# EAGLE design Arduino-CMRI_SMD_v7_Nano (EAGLE 7.6.0)
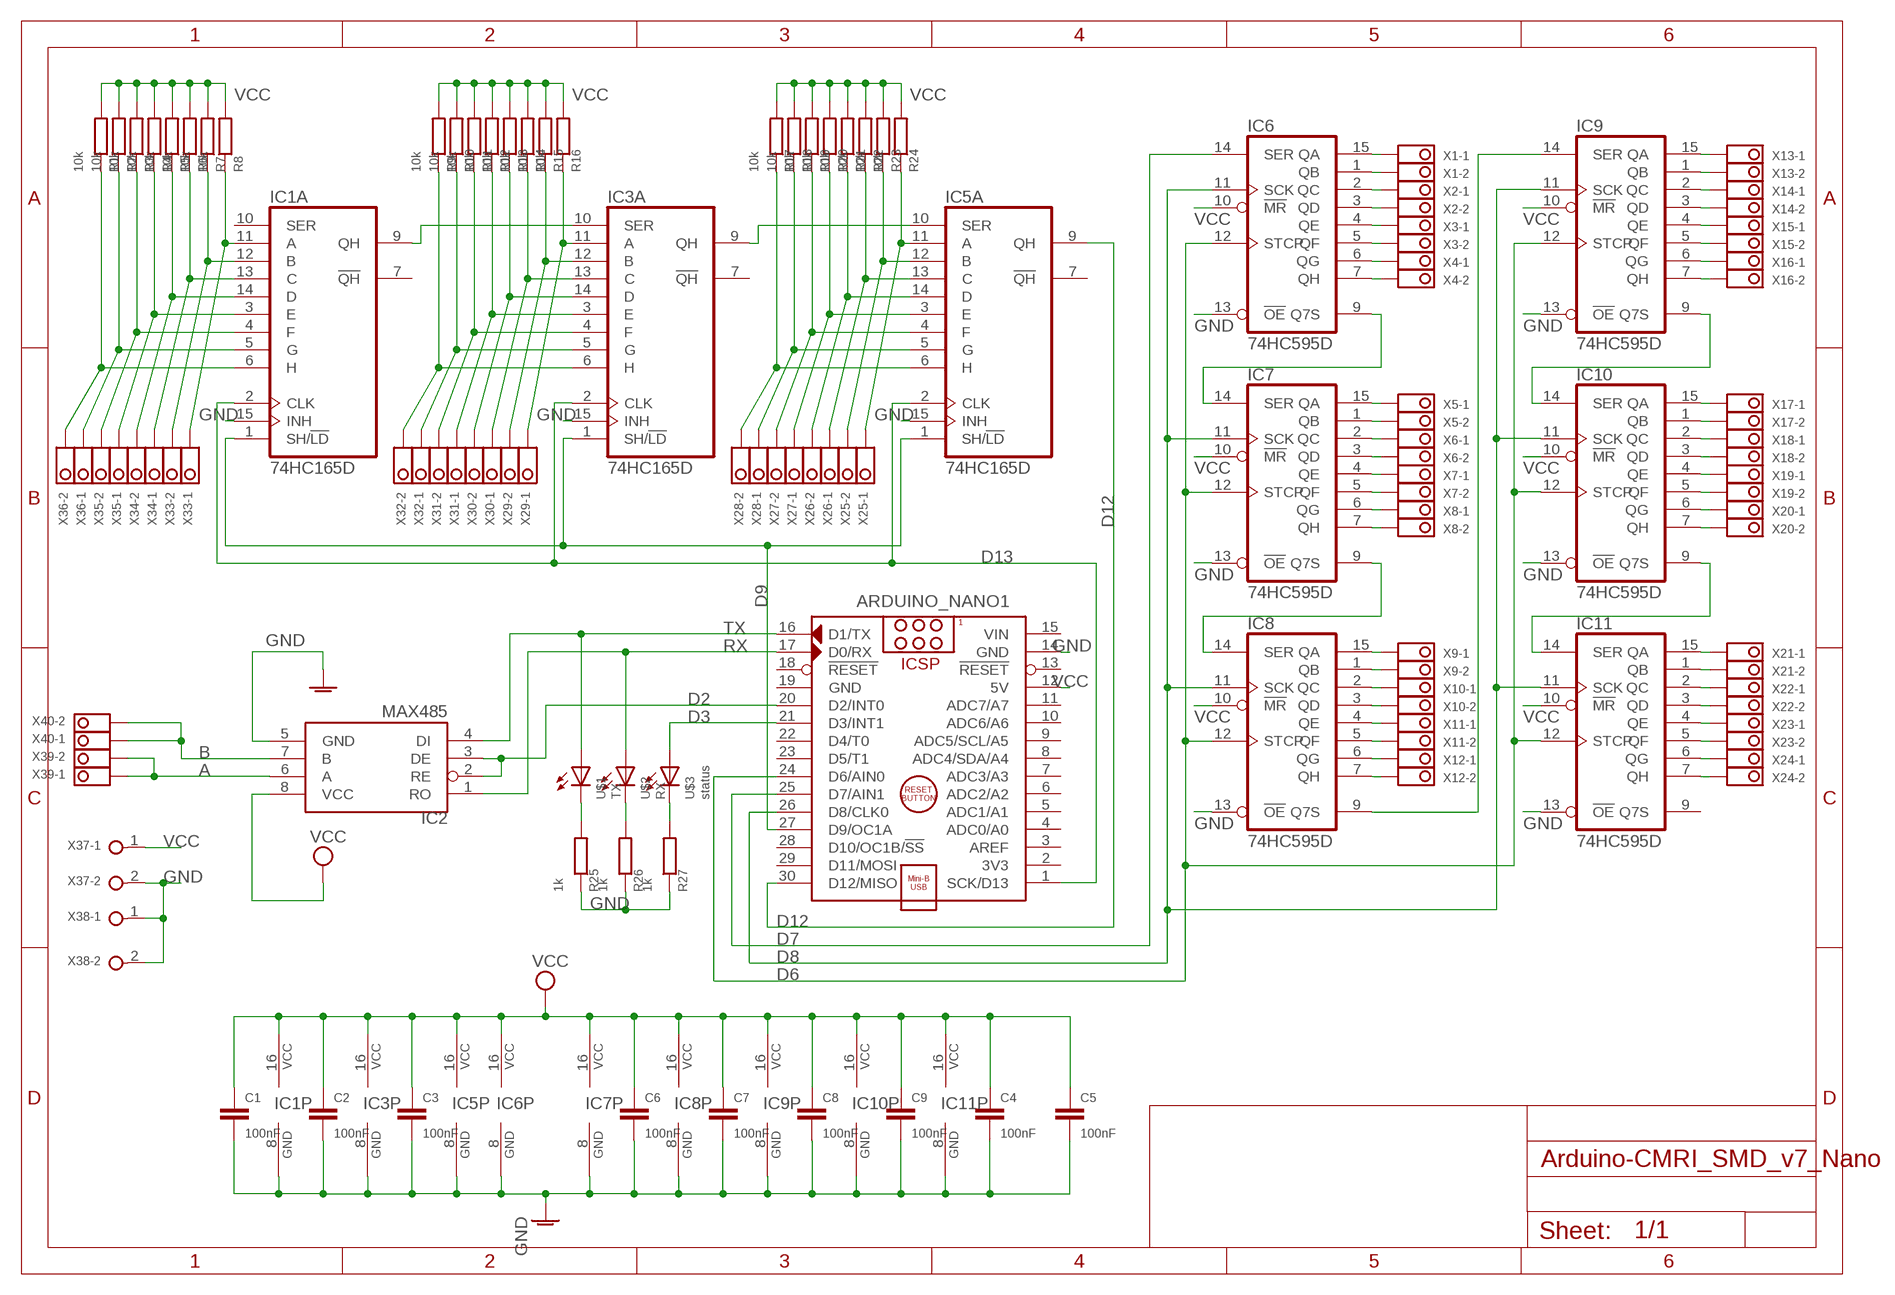
[diagram p0: schematic, sheet 1]

## Parts
ARDUINO_NANO1  ARDUINO_NANO  [ARDUINO_NANO]
C1  100nF  CERAMIC-CAP  [1206]
C2  100nF  CERAMIC-CAP  [1206]
C3  100nF  CERAMIC-CAP  [1206]
C4  100nF  CERAMIC-CAP  [1206]
C5  100nF  CERAMIC-CAP  [1206]
C6  100nF  CERAMIC-CAP  [1206]
C7  100nF  CERAMIC-CAP  [1206]
C8  100nF  CERAMIC-CAP  [1206]
C9  100nF  CERAMIC-CAP  [1206]
IC1  74HC165D  [SO16]
IC2  MAX485  [SO08]
IC3  74HC165D  [SO16]
IC5  74HC165D  [SO16]
IC6  74HC595D  [SO16]
IC7  74HC595D  [SO16]
IC8  74HC595D  [SO16]
IC9  74HC595D  [SO16]
IC10  74HC595D  [SO16]
IC11  74HC595D  [SO16]
R1  10k  RESISTOR-SMD-1206  [R1206W]
R2  10k  RESISTOR-SMD-1206  [R1206W]
R3  10k  RESISTOR-SMD-1206  [R1206W]
R4  10k  RESISTOR-SMD-1206  [R1206W]
R5  10k  RESISTOR-SMD-1206  [R1206W]
R6  10k  RESISTOR-SMD-1206  [R1206W]
R7  10k  RESISTOR-SMD-1206  [R1206W]
R8  10k  RESISTOR-SMD-1206  [R1206W]
R9  10k  RESISTOR-SMD-1206  [R1206W]
R10  10k  RESISTOR-SMD-1206  [R1206W]
R11  10k  RESISTOR-SMD-1206  [R1206W]
R12  10k  RESISTOR-SMD-1206  [R1206W]
R13  10k  RESISTOR-SMD-1206  [R1206W]
R14  10k  RESISTOR-SMD-1206  [R1206W]
R15  10k  RESISTOR-SMD-1206  [R1206W]
R16  10k  RESISTOR-SMD-1206  [R1206W]
R17  10k  RESISTOR-SMD-1206  [R1206W]
R18  10k  RESISTOR-SMD-1206  [R1206W]
R19  10k  RESISTOR-SMD-1206  [R1206W]
R20  10k  RESISTOR-SMD-1206  [R1206W]
R21  10k  RESISTOR-SMD-1206  [R1206W]
R22  10k  RESISTOR-SMD-1206  [R1206W]
R23  10k  RESISTOR-SMD-1206  [R1206W]
R24  10k  RESISTOR-SMD-1206  [R1206W]
R25  1k  RESISTOR-SMD-1206  [R1206W]
R26  1k  RESISTOR-SMD-1206  [R1206W]
R27  1k  RESISTOR-SMD-1206  [R1206W]
U$1  TX  LED-0603CHIPLED_0603_V1  [CHIPLED_0603]
U$2  RX  LED-0603CHIPLED_0603_V1  [CHIPLED_0603]
U$3  status  LED-0603CHIPLED_0603_V1  [CHIPLED_0603]
X1  TERMINAL_2P_3,5MM_V2  [TERMINAL_2P_3,5MM]
X2  TERMINAL_2P_3,5MM_V2  [TERMINAL_2P_3,5MM]
X3  TERMINAL_2P_3,5MM_V2  [TERMINAL_2P_3,5MM]
X4  TERMINAL_2P_3,5MM_V2  [TERMINAL_2P_3,5MM]
X5  TERMINAL_2P_3,5MM_V2  [TERMINAL_2P_3,5MM]
X6  TERMINAL_2P_3,5MM_V2  [TERMINAL_2P_3,5MM]
X7  TERMINAL_2P_3,5MM_V2  [TERMINAL_2P_3,5MM]
X8  TERMINAL_2P_3,5MM_V2  [TERMINAL_2P_3,5MM]
X9  TERMINAL_2P_3,5MM_V2  [TERMINAL_2P_3,5MM]
X10  TERMINAL_2P_3,5MM_V2  [TERMINAL_2P_3,5MM]
X11  TERMINAL_2P_3,5MM_V2  [TERMINAL_2P_3,5MM]
X12  TERMINAL_2P_3,5MM_V2  [TERMINAL_2P_3,5MM]
X13  TERMINAL_2P_3,5MM_V2  [TERMINAL_2P_3,5MM]
X14  TERMINAL_2P_3,5MM_V2  [TERMINAL_2P_3,5MM]
X15  TERMINAL_2P_3,5MM_V2  [TERMINAL_2P_3,5MM]
X16  TERMINAL_2P_3,5MM_V2  [TERMINAL_2P_3,5MM]
X17  TERMINAL_2P_3,5MM_V2  [TERMINAL_2P_3,5MM]
X18  TERMINAL_2P_3,5MM_V2  [TERMINAL_2P_3,5MM]
X19  TERMINAL_2P_3,5MM_V2  [TERMINAL_2P_3,5MM]
X20  TERMINAL_2P_3,5MM_V2  [TERMINAL_2P_3,5MM]
X21  TERMINAL_2P_3,5MM_V2  [TERMINAL_2P_3,5MM]
X22  TERMINAL_2P_3,5MM_V2  [TERMINAL_2P_3,5MM]
X23  TERMINAL_2P_3,5MM_V2  [TERMINAL_2P_3,5MM]
X24  TERMINAL_2P_3,5MM_V2  [TERMINAL_2P_3,5MM]
X25  TERMINAL_2P_3,5MM_V2  [TERMINAL_2P_3,5MM]
X26  TERMINAL_2P_3,5MM_V2  [TERMINAL_2P_3,5MM]
X27  TERMINAL_2P_3,5MM_V2  [TERMINAL_2P_3,5MM]
X28  TERMINAL_2P_3,5MM_V2  [TERMINAL_2P_3,5MM]
X29  TERMINAL_2P_3,5MM_V2  [TERMINAL_2P_3,5MM]
X30  TERMINAL_2P_3,5MM_V2  [TERMINAL_2P_3,5MM]
X31  TERMINAL_2P_3,5MM_V2  [TERMINAL_2P_3,5MM]
X32  TERMINAL_2P_3,5MM_V2  [TERMINAL_2P_3,5MM]
X33  TERMINAL_2P_3,5MM_V2  [TERMINAL_2P_3,5MM]
X34  TERMINAL_2P_3,5MM_V2  [TERMINAL_2P_3,5MM]
X35  TERMINAL_2P_3,5MM_V2  [TERMINAL_2P_3,5MM]
X36  TERMINAL_2P_3,5MM_V2  [TERMINAL_2P_3,5MM]
X37  TERMINAL-5MM-2POLE  [W237-132]
X38  TERMINAL-5MM-2POLE  [W237-132]
X39  TERMINAL_2P_3,5MM_V2  [TERMINAL_2P_3,5MM]
X40  TERMINAL_2P_3,5MM_V2  [TERMINAL_2P_3,5MM]

## Nets
A [Vcc]: IC2.6(A) X39.P$1 X39.P$2
B [Vcc]: IC2.7(B) X40.P$1 X40.P$2
D2: ARDUINO_NANO1.20(D2/INT0) IC2.2(RE) IC2.3(DE)
D3: ARDUINO_NANO1.21(D3/INT1) U$3.A
D6: ARDUINO_NANO1.24(D6/AIN0) IC6.12(STCP) IC7.12(STCP) IC8.12(STCP) IC9.12(STCP) IC10.12(STCP) IC11.12(STCP)
D7: ARDUINO_NANO1.25(D7/AIN1) IC6.14(SER)
D8: ARDUINO_NANO1.26(D8/CLK0) IC6.11(SCK) IC7.11(SCK) IC8.11(SCK) IC9.11(SCK) IC10.11(SCK) IC11.11(SCK)
D9: ARDUINO_NANO1.27(D9/OC1A) IC1.1(A:SH/!LD) IC3.1(A:SH/!LD) IC5.1(A:SH/!LD)
D12: ARDUINO_NANO1.30(D12/MISO) IC5.9(A:QH)
D13: ARDUINO_NANO1.1(SCK/D13) IC1.2(A:CLK) IC3.2(A:CLK) IC5.2(A:CLK)
GND [Vcc]: ARDUINO_NANO1.14(GND) C1.1 C2.1 C3.1 C4.1 C5.1 C6.1 C7.1 C8.1 C9.1 IC1.8(P:GND) IC1.15(A:INH) IC2.5(GND) IC3.8(P:GND) IC3.15(A:INH) IC5.8(P:GND) IC5.15(A:INH) IC6.8(GND) IC6.13(!OE) IC7.8(GND) IC7.13(!OE) IC8.8(GND) IC8.13(!OE) IC9.8(GND) IC9.13(!OE) IC10.8(GND) IC10.13(!OE) IC11.8(GND) IC11.13(!OE) R25.1 R26.1 R27.1 X37.2 X38.1 X38.2
N$1: IC5.11(A:A) R24.1 X25.P$1
N$2: IC1.9(A:QH) IC3.10(A:SER)
N$3: IC5.12(A:B) R23.1 X25.P$2
N$4: IC3.9(A:QH) IC5.10(A:SER)
N$5: IC5.13(A:C) R22.1 X26.P$1
N$6: IC6.9(Q7S) IC7.14(SER)
N$7: IC5.14(A:D) R21.1 X26.P$2
N$8: IC9.9(Q7S) IC10.14(SER)
N$9: IC5.3(A:E) R20.1 X27.P$1
N$10: IC7.9(Q7S) IC8.14(SER)
N$11: IC5.4(A:F) R19.1 X27.P$2
N$12: IC10.9(Q7S) IC11.14(SER)
N$13: IC5.5(A:G) R18.1 X28.P$1
N$14: IC6.15(QA) X1.P$1
N$15: IC5.6(A:H) R17.1 X28.P$2
N$16: IC6.1(QB) X1.P$2
N$17: R25.2 U$1.C
N$18: IC6.2(QC) X2.P$1
N$19: IC3.11(A:A) R16.1 X29.P$1
N$20: IC6.3(QD) X2.P$2
N$21: IC3.12(A:B) R15.1 X29.P$2
N$22: IC6.4(QE) X3.P$1
N$23: IC3.13(A:C) R14.1 X30.P$1
N$24: IC6.5(QF) X3.P$2
N$25: IC3.14(A:D) R13.1 X30.P$2
N$26: IC6.6(QG) X4.P$1
N$27: IC3.3(A:E) R12.1 X31.P$1
N$28: IC6.7(QH) X4.P$2
N$29: IC3.4(A:F) R11.1 X31.P$2
N$30: IC7.15(QA) X5.P$1
N$31: IC3.5(A:G) R10.1 X32.P$1
N$32: IC7.1(QB) X5.P$2
N$33: IC3.6(A:H) R9.1 X32.P$2
N$34: IC7.2(QC) X6.P$1
N$35: IC1.11(A:A) R8.1 X33.P$1
N$36: IC7.3(QD) X6.P$2
N$37: IC1.12(A:B) R7.1 X33.P$2
N$38: IC7.4(QE) X7.P$1
N$39: IC1.13(A:C) R6.1 X34.P$1
N$40: IC7.5(QF) X7.P$2
N$41: IC1.14(A:D) R5.1 X34.P$2
N$42: IC7.6(QG) X8.P$1
N$43: IC1.3(A:E) R4.1 X35.P$1
N$44: IC7.7(QH) X8.P$2
N$45: IC1.4(A:F) R3.1 X35.P$2
N$46: IC8.15(QA) X9.P$1
N$47: IC1.5(A:G) R2.1 X36.P$1
N$48: IC8.1(QB) X9.P$2
N$49: IC8.2(QC) X10.P$1
N$50: IC8.3(QD) X10.P$2
N$51: IC8.9(Q7S) IC9.14(SER)
N$52: IC8.4(QE) X11.P$1
N$53: IC8.5(QF) X11.P$2
N$54: R26.2 U$2.C
N$57: IC1.6(A:H) R1.1 X36.P$2
N$58: R27.2 U$3.C
N$59: IC8.6(QG) X12.P$1
N$60: IC8.7(QH) X12.P$2
N$61: IC9.15(QA) X13.P$1
N$62: IC9.1(QB) X13.P$2
N$63: IC9.2(QC) X14.P$1
N$64: IC9.3(QD) X14.P$2
N$65: IC9.4(QE) X15.P$1
N$66: IC9.5(QF) X15.P$2
N$67: IC9.6(QG) X16.P$1
N$69: IC9.7(QH) X16.P$2
N$71: IC10.15(QA) X17.P$1
N$72: IC10.1(QB) X17.P$2
N$73: IC10.2(QC) X18.P$1
N$74: IC10.3(QD) X18.P$2
N$75: IC10.4(QE) X19.P$1
N$76: IC10.5(QF) X19.P$2
N$77: IC10.6(QG) X20.P$1
N$78: IC10.7(QH) X20.P$2
N$79: IC11.15(QA) X21.P$1
N$80: IC11.1(QB) X21.P$2
N$81: IC11.2(QC) X22.P$1
N$82: IC11.3(QD) X22.P$2
N$83: IC11.4(QE) X23.P$1
N$84: IC11.5(QF) X23.P$2
N$85: IC11.6(QG) X24.P$1
N$86: IC11.7(QH) X24.P$2
RX: ARDUINO_NANO1.17(D0/RX) IC2.1(RO) U$2.A
TX: ARDUINO_NANO1.16(D1/TX) IC2.4(DI) U$1.A
VCC [Vcc]: ARDUINO_NANO1.12(5V) C1.2 C2.2 C3.2 C4.2 C5.2 C6.2 C7.2 C8.2 C9.2 IC1.16(P:VCC) IC2.8(VCC) IC3.16(P:VCC) IC5.16(P:VCC) IC6.10(!MR) IC6.16(VCC) IC7.10(!MR) IC7.16(VCC) IC8.10(!MR) IC8.16(VCC) IC9.10(!MR) IC9.16(VCC) IC10.10(!MR) IC10.16(VCC) IC11.10(!MR) IC11.16(VCC) R1.2 R2.2 R3.2 R4.2 R5.2 R6.2 R7.2 R8.2 R9.2 R10.2 R11.2 R12.2 R13.2 R14.2 R15.2 R16.2 R17.2 R18.2 R19.2 R20.2 R21.2 R22.2 R23.2 R24.2 X37.1
Unconnected: ARDUINO_NANO1.2(3V3) ARDUINO_NANO1.3(AREF) ARDUINO_NANO1.4(ADC0/A0) ARDUINO_NANO1.5(ADC1/A1) ARDUINO_NANO1.6(ADC2/A2) ARDUINO_NANO1.7(ADC3/A3) ARDUINO_NANO1.8(ADC4/SDA/A4) ARDUINO_NANO1.9(ADC5/SCL/A5) ARDUINO_NANO1.10(ADC6/A6) ARDUINO_NANO1.11(ADC7/A7) ARDUINO_NANO1.13(!RESET) ARDUINO_NANO1.18(!RESET) ARDUINO_NANO1.22(D4/T0) ARDUINO_NANO1.23(D5/T1) ARDUINO_NANO1.28(D10/OC1B/!SS) ARDUINO_NANO1.29(D11/MOSI) IC1.7(A:!QH) IC1.10(A:SER) IC3.7(A:!QH) IC5.7(A:!QH) IC11.9(Q7S)

## Power pins joined to a net without a drawn wire
GND: ARDUINO_NANO1.19(GND)
VIN: ARDUINO_NANO1.15(VIN)

## Library data of the parts
ARDUINO_NANO1 = JMRI CMRI:ARDUINO_NANO: Arduino Nano V3.0 Module Overview: The Arduino Nano is a small, complete, and breadboard-friendly board based on the ATmega328 (Arduino Nano 3.x) or ATmega168 (Arduino Nano 2.x). It has more or less the same functionality of the Arduino Duemilanove, but in a different package. It lacks only a DC power jack, and works with a Mini-B USB cable instead of a standard one. The Nano was designed and is being produced by Gravitech <http://www.gravitech.us/arna30wiatp.html>. General specifications: Item Value Microcontroller Atmel ATmega168 or ATmega328 Operating Voltage (logic level) 5 V Input Voltage (recommended) 7-12 V Input Voltage (limits) 6-20 V Digital I/O Pins 14 (of which 6 provide PWM output) Analog Input Pins 8 DC Current per I/O Pin 40 mA Flash Memory 16 KB (ATmega168) or 32 KB (ATmega328) of which 2 KB used by bootloader SRAM 1 KB (ATmega168) or 2 KB (ATmega328) EEPROM 512 bytes (ATmega168) or 1 KB (ATmega328) Clock Speed 16 MHz Dimensions (Inches) 0.73" x 1.70" Dimensions (mm) 18mm x 45mm Overall height About 9 mm (not including pins) Weigth 5 g Power: The Arduino Nano can be powered via the Mini-B USB connection, 6-20V unregulated external power supply (pin 30), or 5V regulated external power supply (pin 27). The power source is automatically selected to the highest voltage source. Memory: The ATmega168 has 16 KB of flash memory for storing code (of which 2 KB is used for the bootloader); the ATmega328 has 32 KB, (also with 2 KB used for the bootloader). The ATmega168 has 1 KB of SRAM and 512 bytes of EEPROM (which can be read and written with the EEPROM library); the ATmega328 has 2 KB of SRAM and 1 KB of EEPROM. Input and Output: Each of the 14 digital pins on the Nano can be used as an input or output, using pinMode(), digitalWrite(), and digitalRead() functions. They operate at 5 volts. Each pin can provide or receive a maximum of 40 mA and has an internal pull-up resistor (disconnected by default) of 20-50 kOhms. In addition, some pins have specialized functions. Visit Arduino - ArduinoBoardNano <https://www.arduino.cc/en/Main/ArduinoBoardNano>
C1-C9 = JMRI CMRI:CERAMIC-CAP: ceramic capacitor leads 2.5mm and 5.5mm
IC1 IC3 IC5 = JMRI CMRI:74*165: 8-bit parallel load SHIFT REGISTER
IC2 = JMRI CMRI:MAX485
IC6-IC11 = JMRI CMRI:74*595: 8-bit SHIFT REGISTER, output latch
R1-R27 = JMRI CMRI:RESISTOR-SMD-1206: Resistor 1/4W H wide fit
U$1-U$3 = JMRI CMRI:LED-0603: LED SMD mount
X1-X36 X39 X40 = JMRI CMRI:TERMINAL_2P_3,5MM_V2: MKDS 1/ 2-3,5 Printklemme Nennstrom: 10 A Bemessungsspannung: 160 V Raster: 3,5 mm Polzahl: 2 Montageart: Löten Anschlussart: Schraubanschluss Anschlussrichtung vom Leiter zur Platine: 0° Source: http://eshop.phoenixcontact.com .. 1751248.pdf; OC_FARNELL: unknown; OC_NEWARK: unknown
X37 X38 = JMRI CMRI:TERMINAL-5MM-2POLE: WAGO SCREW CLAMP; OC_FARNELL: unknown; OC_NEWARK: unknown

## Net classes
1 Vcc: width 0.61 mm

## Board
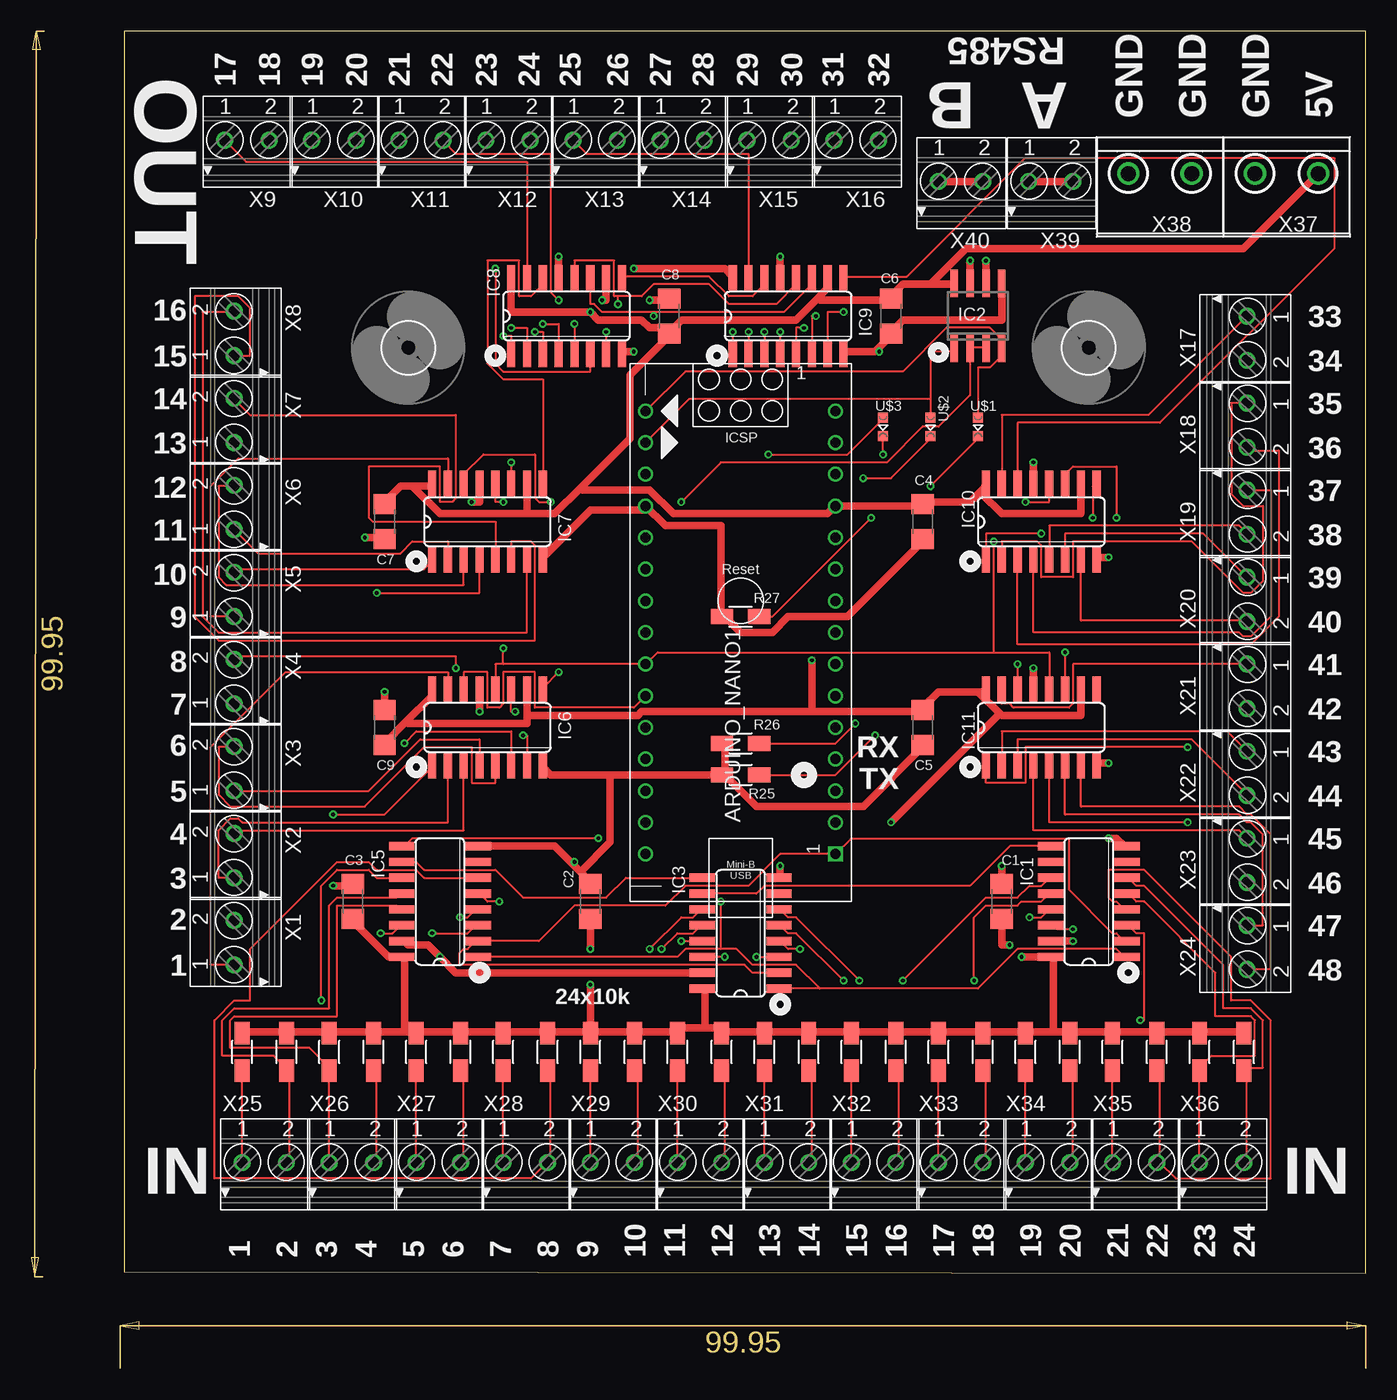
[diagram p1: board, top side]
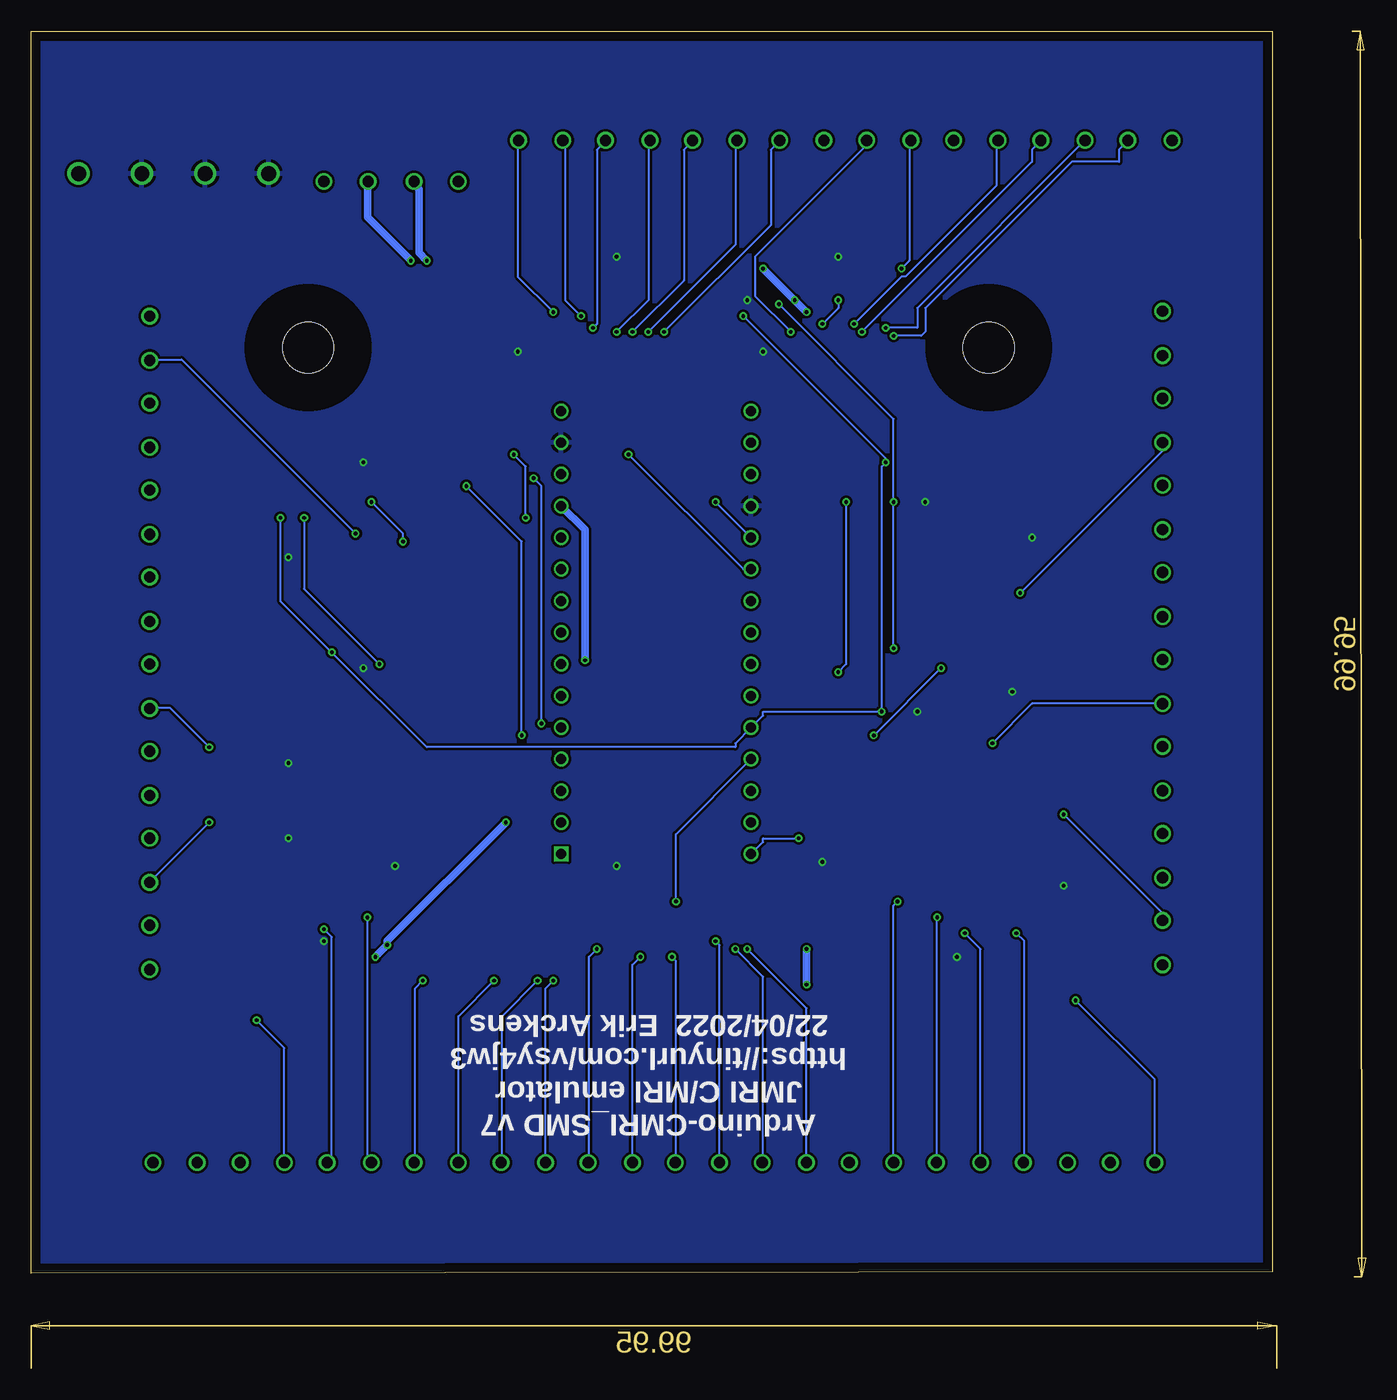
[diagram p2: board, bottom side, seen from below]

Size 99.62 x 99.67 mm. Coordinates in mm from the lower left corner, seen from the top.
Outline: 99.62,0 99.62,99.67 0,99.67 0,0.13 99.62,0
Copper layers (1*16): Top 0.035mm / dielectric 1.6mm / Bottom 0.035mm
Design rules "Elecrow_2-layer_PCB_rule_ALT_1": minimum track width 6mil, minimum drill 12mil, track to track 8mil, track to pad 8mil, pad to pad 8mil, via to via 8mil, smd to smd 0mil, copper to edge 30mil, drill to drill 10mil, minimum pad ring 6mil, minimum via ring 6mil, stop-mask expansion 0mil, vias tented up to drill 100mil, thermal gap 10mil

### Footprints (pad centres in the part's own frame; a part is rotated, then mirrored left to right if it is on the bottom)
ARDUINO_NANO = drill 0.8 square: 1 -20.32,-7.62 | drill 0.8: 2 -17.78,-7.62; 3 -15.24,-7.62; 4 -12.7,-7.62; 5 -10.16,-7.62; 6 -7.62,-7.62; 7 -5.08,-7.62; 8 -2.54,-7.62; 9 0,-7.62; 10 2.54,-7.62; 11 5.08,-7.62; 12 7.62,-7.62; 13 10.16,-7.62; 14 12.7,-7.62; 15 15.24,-7.62; 16 15.24,7.62; 17 12.7,7.62; 18 10.16,7.62; 19 7.62,7.62; 20 5.08,7.62; 21 2.54,7.62; 22 0,7.62; 23 -2.54,7.62; 24 -5.08,7.62; 25 -7.62,7.62; 26 -10.16,7.62; 27 -12.7,7.62; 28 -15.24,7.62; 29 -17.78,7.62; 30 -20.32,7.62
1206 = smd 1.6 x 1.8: 1 -1.4,0; 2 1.4,0
4,1 = hole 4.1: 0,0
SO16 = smd 0.66 x 2.032: 1 -4.445,-3.073; 2 -3.175,-3.073; 3 -1.905,-3.073; 4 -0.635,-3.073; 5 0.635,-3.073; 6 1.905,-3.073; 7 3.175,-3.073; 8 4.445,-3.073; 9 4.445,3.073; 10 3.175,3.073; 11 1.905,3.073; 12 0.635,3.073; 13 -0.635,3.073; 14 -1.905,3.073; 15 -3.175,3.073; 16 -4.445,3.073
SO08 = smd 0.6 x 2.2: 1 -1.905,-2.6; 2 -0.635,-2.6; 3 0.635,-2.6; 4 1.905,-2.6; 5 1.905,2.6; 6 0.635,2.6; 7 -0.635,2.6; 8 -1.905,2.6
R1206W = smd 1.8 x 1.2: 1 -1.499,0; 2 1.499,0
CHIPLED_0603 = smd 0.8 x 0.8: A 0,-0.75; C 0,0.75
TERMINAL_2P_3,5MM = drill 0.9: P$1 -1.27,0; P$2 2.286,0
W237-132 = drill 1.194: 1 -2.54,-0.635; 2 2.54,-0.635

### Placement (x,y rotation side)
ARDUINO_NANO1  49.45,53.98 90 top
C1  70.41,29.84 270 top
C2  37.39,29.84 270 top
C3  18.34,29.84 270 top
C4  64.06,60.32 90 top
C5  64.06,43.81 90 top
C6  61.52,76.84 90 top
C7  20.88,60.32 90 top
C8  43.74,76.84 270 top
C9  20.88,43.81 270 top
H1  MOUNT-HOLE4.1  [4,1]  22.78,74.3 0 top
H2  MOUNT-HOLE4.1  [4,1]  77.39,74.3 0 top
IC1  77.39,29.84 90 top
IC2  68.5,76.84 0 top
IC3  49.45,27.3 90 top
IC5  25.32,29.84 90 top
IC6  29.13,43.81 0 top
IC7  29.13,60.32 0 top
IC8  35.48,76.84 0 top
IC9  53.26,76.84 0 top
IC10  73.58,60.32 0 top
IC11  73.58,43.81 0 top
R1  89.84,17.78 90 top
R2  86.28,17.78 90 top
R3  82.86,17.78 90 top
R4  79.3,17.78 90 top
R5  75.87,17.78 90 top
R6  72.31,17.78 90 top
R7  68.89,17.78 90 top
R8  65.33,17.78 90 top
R9  61.9,17.78 90 top
R10  58.34,17.78 90 top
R11  54.91,17.78 90 top
R12  51.36,17.78 90 top
R13  47.93,17.78 90 top
R14  44.37,17.78 90 top
R15  40.95,17.78 90 top
R16  37.39,17.78 90 top
R17  33.96,17.78 90 top
R18  30.4,17.78 90 top
R19  26.98,17.78 90 top
R20  23.42,17.78 90 top
R21  19.99,17.78 90 top
R22  16.43,17.78 90 top
R23  13.01,17.78 90 top
R24  9.45,17.78 90 top
R25  49.45,40 0 top
R26  49.45,42.55 0 top
R27  49.45,52.7 0 top
U$1  68.5,67.94 180 top
U$2  64.69,67.94 180 top
U$3  60.88,67.94 180 top
X1  8.81,26.03 90 top
X2  8.81,33.02 90 top
X3  8.81,40 90 top
X4  8.81,46.99 90 top
X5  8.81,53.98 90 top
X6  8.81,60.96 90 top
X7  8.81,67.94 90 top
X8  8.81,74.93 90 top
X9  9.32,90.93 0 top
X10  16.31,90.93 0 top
X11  23.29,90.93 0 top
X12  30.28,90.93 0 top
X13  37.26,90.93 0 top
X14  44.25,90.93 0 top
X15  51.23,90.93 0 top
X16  58.22,90.93 0 top
X17  90.09,75.56 270 top
X18  90.09,68.58 270 top
X19  90.09,61.59 270 top
X20  90.09,54.61 270 top
X21  90.09,47.62 270 top
X22  90.09,40.64 270 top
X23  90.09,33.66 270 top
X24  90.09,26.67 270 top
X25  10.72,8.89 0 top
X26  17.7,8.89 0 top
X27  24.69,8.89 0 top
X28  31.67,8.89 0 top
X29  38.66,8.89 0 top
X30  45.64,8.89 0 top
X31  52.63,8.89 0 top
X32  59.61,8.89 0 top
X33  66.6,8.89 0 top
X34  73.58,8.89 0 top
X35  80.57,8.89 0 top
X36  87.55,8.89 0 top
X37  93.27,87.63 180 top
X38  83.11,87.63 180 top
X39  73.84,87.63 0 top
X40  66.6,87.63 0 top

### Tracks (layer width: path | path; a pad name or v marks a point on that pad's centre or on a via)
A  (via drill 0.3)
  Top 0.61: v69.14,81.28 IC2.6 | X39.P$1 X39.P$2
  Bottom 0.61: v69.14,81.28 72.63,84.77 72.63,87.63 X39.P$1
B  (via drill 0.3)
  Top 0.61: v67.87,81.28 IC2.7 | X40.P$2 X40.P$1
  Bottom 0.61: v67.87,81.28 68.5,81.91 68.5,87 68.82,87.31 68.82,87.63 X40.P$2
D2  (via drill 0.3)
  Top 0.152: IC2.3 69.14,74.3 67.87,74.3 IC2.2 67.87,70.48 65.33,67.94 64.06,67.94 61.2,65.09 47.87,65.09 v44.69,61.91
  Bottom 0.152: v44.69,61.91 ARDUINO_NANO1.20
D3  (via drill 0.3)
  Top 0.152: v51.68,65.72 58.03,65.72 60.88,68.58 U$3.A
  Bottom 0.152: v51.68,65.72 42.47,56.52 ARDUINO_NANO1.21
D6  (via drill 0.3)
  Top 0.152: IC8.12 36.12,81.28 39.29,81.28 39.29,78.42 39.61,78.42 | 39.61,78.42 41.52,78.42 42.47,79.38 46.91,79.38 48.5,77.79 52.31,77.79 53.9,79.38 IC9.12 | IC6.12 29.77,48.89 30.4,48.89 | 30.4,48.89 ARDUINO_NANO1.24 42.79,49.85 69.77,49.85 | IC7.12 29.77,61.91 v30.4,61.91 | 30.4,48.89 v30.4,50.16 | IC11.12 74.22,49.85 69.77,49.85 | IC10.12 74.22,61.91 v72.31,61.91 | 69.77,49.85 v69.77,58.74 | v39.61,77.79 39.61,78.42
  Bottom 0.152: v30.4,50.16 v30.4,61.91 30.4,68.58 v39.61,77.79 | v72.31,61.91 69.77,59.37 v69.77,58.74
D7
  Top 0.152: IC6.14 27.23,48.26 29.13,48.26 29.13,45.4 30.09,45.4 30.4,45.72 30.4,48.26 32.94,48.26 32.94,45.4 40.88,45.4 ARDUINO_NANO1.25
D8  (via drill 0.3)
  Top 0.152: v75.49,49.85 IC11.11 | v79.62,60.64 79.62,64.77 76.12,64.77 75.49,64.13 IC10.11 | IC8.11 37.39,77.79 37.71,77.79 38.34,77.15 42.47,77.15 | 42.47,77.15 52.95,77.15 55.17,79.38 IC9.11 | IC6.11 31.04,45.08 v31.36,45.08 | v31.04,65.09 IC7.11 | v42.47,76.84 42.47,77.15
  Bottom 0.152: v79.62,60.64 79.62,53.98 v75.49,49.85 67.87,42.23 43.1,42.23 43.1,42.55 ARDUINO_NANO1.26 40.88,44.77 40.88,45.08 v31.36,45.08 31.36,64.77 v31.04,65.09 31.04,65.41 v42.47,76.84
D9  (via drill 0.3)
  Top 0.152: 55.8,22.86 68.5,22.86 71.68,26.03 79.62,26.03 80.25,25.4 IC1.1 | 55.8,22.86 IC3.1 | IC5.1 44.37,25.4 45.01,26.03 47.87,26.03 | 47.87,26.03 49.14,26.03 50.41,24.76 53.9,24.76 55.8,22.86 | 47.87,26.03 v47.87,29.84
  Bottom 0.152: ARDUINO_NANO1.27 47.87,35.24 v47.87,29.84
D12  (via drill 0.3)
  Top 0.152: v38.02,34.92 23.1,34.92 22.47,34.29 IC5.9
  Bottom 0.152: v38.02,34.92 40.88,34.92 40.88,34.61 ARDUINO_NANO1.30
D13
  Top 0.152: IC3.2 50.41,24.13 49.77,24.76 26.91,24.76 26.91,25.72 27.23,26.03 27.55,26.03 28.18,26.67 IC5.2 33.26,26.67 36.12,29.53 43.42,29.53 45.01,31.11 50.09,31.11 52.63,33.66 ARDUINO_NANO1.1 58.34,34.92 75.81,34.92 75.81,30.8 79.3,27.3 79.62,27.3 80.25,26.67 IC1.2
GND  (via drill 0.3)
  Top 0.61: 35.96,32.86 34.53,34.29 IC5.8 | 35.96,32.86 36.59,32.23 | 36.59,32.23 37.39,31.43 C2.1 | 48.18,40 48.18,42.55 R26.1 | 48.18,40 50.72,37.47 59.3,37.47 64.06,42.23 C5.1 | 48.18,40 R25.1 38.98,40 | 38.98,40 34.21,40 33.58,40.64 IC6.8 | 36.59,32.23 38.98,34.61 38.98,40 | IC3.15 26.59,24.13 v25.32,25.4 24.37,26.35 22.78,26.35 22.47,26.67 IC5.15 | 60.41,74.14 60.25,73.98 57.71,73.98 IC9.8 | 60.41,74.14 61.52,75.25 C6.1 61.52,75.56 62.47,76.52 70.41,76.52 IC2.5 | v16.75,31.11 18.34,31.11 C3.1 | v20.88,46.67 C9.1 | v19.29,59.05 20.88,59.05 C7.1 | v70.41,32.7 C1.1 | C4.1 64.06,58.74 58.03,52.7 53.26,52.7 51.99,51.44 49.45,51.44 48.18,52.7 R27.1 47.87,52.7 47.87,60.01 43.42,60.01 ARDUINO_NANO1.19 41.83,61.28 37.39,61.28 33.58,57.47 IC7.8 | v42.15,78.1 43.74,78.1 C8.1 | v28.5,45.08 IC6.13 | v52.63,32.7 52.63,31.75 IC3.8 | IC7.13 28.5,61.91 v27.86,61.91 | v76.12,26.67 IC1.15 | v40.88,73.98 39.93,73.98 IC8.8 | v78.98,34.92 79.62,34.92 80.25,34.29 IC1.8 | v34.85,81.6 IC8.13 | v78.98,40.96 78.03,40.96 IC11.8 | v72.95,48.58 IC11.13 | v72.95,65.09 IC10.13 | v52.63,81.6 IC9.13 | v78.98,57.47 78.03,57.47 IC10.8 | v60.57,73.98 60.41,74.14 | v36.12,33.02 35.96,32.86
  pour Bottom: -0.08,99.69 99.62,99.69 99.62,0 -0.08,0
N$1  (via drill 0.3)
  Top 0.152: X25.P$1 R24.1 | IC5.11 20.24,31.75 19.61,32.38 17.07,32.38 15.8,31.11 v15.8,21.91
  Bottom 0.152: v15.8,21.91 9.45,15.56 X25.P$1
N$2
  Top 0.152: IC3.10 50.72,30.48 51.36,31.11 67.87,31.11 71.04,34.29 IC1.9
N$3
  Top 0.152: X25.P$2 13.26,8.89 13.26,16.19 R23.1 12.94,16.51 11.99,17.46 7.86,17.46 7.86,20.32 8.81,21.27 16.43,21.27 16.43,29.53 17.07,30.16 21.83,30.16 22.15,30.48 IC5.12
N$4
  Top 0.152: IC3.9 40.25,31.75 38.66,30.16 31.99,30.16 29.77,32.38 24.05,32.38 23.42,33.02 IC5.10
N$5
  Top 0.152: X26.P$1 R22.1 16.43,16.51 14.85,18.1 8.5,18.1 8.5,20.32 8.81,20.64 17.07,20.64 17.07,29.53 21.83,29.53 22.15,29.21 IC5.13
N$6  (via drill 0.3)
  Top 0.152: v34.85,48.26 33.58,46.99 IC6.9 | v34.21,61.91 33.26,61.91 32.94,62.23 32.94,65.72 28.82,65.72 27.23,64.13 IC7.14
  Bottom 0.152: v34.85,48.26 34.21,48.89 v34.21,61.91
N$7  (via drill 0.3)
  Top 0.152: R21.1 20.24,16.19 20.24,8.89 X26.P$2 | v20.56,27.3 21.51,27.3 22.15,27.94 IC5.14
  Bottom 0.152: v20.56,27.3 19.93,26.67 19.93,8.89 X26.P$2
N$8
  Top 0.152: IC10.14 71.68,68.26 83.11,68.26 97.08,82.23 97.08,89.53 72.31,89.53 62.79,80.01 57.71,80.01 IC9.9
N$9  (via drill 0.3)
  Top 0.152: X27.P$1 R20.1 | v24.69,27.3 27.55,27.3 28.18,27.94 IC5.3
  Bottom 0.152: v24.69,27.3 23.42,26.03 X27.P$1
N$10
  Top 0.152: IC7.9 33.58,71.75 30.4,71.75 29.13,73.03 29.13,81.28 31.67,81.28 31.67,78.42 32.63,78.42 33.58,79.38 IC8.14
N$11  (via drill 0.3)
  Top 0.152: R19.1 27.23,16.19 27.23,8.89 X27.P$2 | v26.91,28.57 27.55,28.57 28.18,29.21 IC5.4
  Bottom 0.152: v26.91,28.57 26.91,8.89 X27.P$2
N$12  (via drill 0.3)
  Top 0.152: v71.68,48.89 IC11.14 | v77.71,60.64 77.71,63.18 78.03,63.18 IC10.9
  Bottom 0.152: v71.68,48.89 77.71,54.93 v77.71,60.64
N$13  (via drill 0.3)
  Top 0.152: X28.P$1 R18.1 | v30.09,29.84 29.13,29.84 28.5,30.48 IC5.5
  Bottom 0.152: v30.09,29.84 30.4,29.53 X28.P$1
N$14
  Top 0.152: IC6.15 25.96,48.26 12.94,48.26 6.91,42.23 6.91,24.76 X1.P$1
N$15
  Top 0.152: R17.1 34.21,16.19 34.21,8.89 X28.P$2 33.9,8.89 32.63,7.62 7.23,7.62 7.23,20.32 8.81,21.91 10.08,21.91 10.08,26.03 17.07,33.02 19.61,33.02 20.24,32.38 23.42,32.38 24.05,31.75 IC5.6
N$16  (via drill 0.3)
  Top 0.152: v16.75,36.83 20.88,36.83 24.69,40.64 IC6.1
  Bottom 0.152: v16.75,36.83 8.81,28.89 X1.P$2
N$17  (via drill 0.3)
  Top 0.152: v64.69,63.18 68.5,66.99 U$1.C | v60.25,43.18 57.07,40 R25.2
  Bottom 0.152: v64.69,63.18 60.25,58.74 v60.25,43.18
N$18
  Top 0.152: IC6.2 25.96,36.2 9.45,36.2 9.13,36.51 8.5,36.51 7.54,35.56 7.54,31.75 X2.P$1
N$19  (via drill 0.3)
  Top 0.152: X29.P$1 R16.1 | v42.15,26.03 44.69,28.57 45.64,28.57 46.28,29.21 IC3.11
  Bottom 0.152: v42.15,26.03 37.39,21.27 X29.P$1
N$20
  Top 0.152: IC6.3 27.23,35.56 8.81,35.56 X2.P$2
N$21  (via drill 0.3)
  Top 0.152: R15.1 41.2,16.19 41.2,8.89 X29.P$2 | v43.1,26.03 44.37,27.3 45.64,27.3 46.28,27.94 IC3.12
  Bottom 0.152: v43.1,26.03 40.88,23.81 40.88,8.89 X29.P$2
N$22
  Top 0.152: IC6.4 28.5,42.86 23.74,42.86 19.61,38.73 X3.P$1
N$23  (via drill 0.3)
  Top 0.152: X30.P$1 R14.1 | v44.69,26.67 IC3.13
  Bottom 0.152: v44.69,26.67 44.37,26.35 X30.P$1
N$24
  Top 0.152: IC6.5 29.77,39.37 27.86,39.37 27.86,42.23 24.05,42.23 19.29,37.47 8.5,37.47 7.54,38.42 7.54,42.23 8.81,42.23 X3.P$2
N$25  (via drill 0.3)
  Top 0.152: R13.1 48.18,16.19 48.18,8.89 X30.P$2 | v48.18,25.4 IC3.14
  Bottom 0.152: v48.18,25.4 47.87,25.08 47.87,8.89 X30.P$2
N$26  (via drill 0.3)
  Top 0.152: IC6.6 31.04,43.5 23.42,43.5 v22.47,42.55
  Bottom 0.152: v22.47,42.55 19.29,45.72 X4.P$1
N$27  (via drill 0.3)
  Top 0.152: X31.P$1 R12.1 | v50.72,25.4 IC3.3
  Bottom 0.152: v50.72,25.4 51.36,24.76 X31.P$1
N$28  (via drill 0.3)
  Top 0.152: IC6.7 32.31,43.18 v31.99,43.18 | v26.59,48.58 26.59,49.53 8.81,49.53 X4.P$2
  Bottom 0.152: v26.59,48.58 v31.99,43.18
N$29  (via drill 0.3)
  Top 0.152: R11.1 55.17,16.19 55.17,8.89 X31.P$2 | v54.22,26.03 53.26,26.03 52.63,26.67 IC3.4
  Bottom 0.152: v54.22,26.03 54.85,25.4 54.85,8.89 X31.P$2
N$30
  Top 0.152: IC7.15 25.96,65.41 9.13,65.41 6.91,63.18 6.91,52.7 X5.P$1
N$31  (via drill 0.3)
  Top 0.152: X32.P$1 R10.1 | v57.71,23.49 53.9,27.3 53.26,27.3 52.63,27.94 IC3.5
  Bottom 0.152: v57.71,23.49 58.34,22.86 X32.P$1
N$32
  Top 0.152: IC7.1 24.69,57.15 24.05,56.52 8.81,56.52 X5.P$2
N$33  (via drill 0.3)
  Top 0.152: R9.1 62.15,16.19 62.15,8.89 X32.P$2 | v58.98,23.49 53.9,28.57 53.26,28.57 52.63,29.21 IC3.6
  Bottom 0.152: v58.98,23.49 61.84,20.64 61.84,8.89 X32.P$2
N$34
  Top 0.152: IC7.2 25.96,58.74 23.1,58.74 22.15,57.78 10.72,57.78 X6.P$1
N$35  (via drill 0.3)
  Top 0.152: X33.P$1 R8.1 | v62.47,23.49 69.14,30.16 71.68,30.16 72.63,31.11 73.58,31.11 74.22,31.75 IC1.11
  Bottom 0.152: v62.47,23.49 65.33,20.64 X33.P$1
N$36
  Top 0.152: IC7.3 27.23,55.24 8.18,55.24 7.54,55.88 7.54,63.18 8.81,63.18 X6.P$2
N$37  (via drill 0.3)
  Top 0.152: R7.1 69.14,16.19 69.14,8.89 X33.P$2 | v68.19,23.49 68.19,28.57 69.14,29.53 71.68,29.53 72,29.84 73.58,29.84 74.22,30.48 IC1.12
  Bottom 0.152: v68.19,23.49 68.82,22.86 68.82,8.89 X33.P$2
N$38  (via drill 0.3)
  Top 0.152: IC7.4 28.5,54.61 v20.24,54.61
  Bottom 0.152: v20.24,54.61 8.81,66.04 X7.P$1
N$39  (via drill 0.3)
  Top 0.152: X34.P$1 R6.1 | v72.63,28.57 73.58,28.57 74.22,29.21 IC1.13
  Bottom 0.152: v72.63,28.57 72.63,9.21 X34.P$1
N$40
  Top 0.152: IC7.5 29.77,60.32 19.93,60.32 19.61,60.64 19.61,64.77 25.32,64.77 25.32,61.91 26.28,61.91 26.59,62.23 26.59,68.9 10.08,68.9 8.81,70.17 X7.P$2
N$41  (via drill 0.3)
  Top 0.152: R5.1 76.12,16.19 76.12,8.89 X34.P$2 | v76.12,27.62 74.85,27.62 74.54,27.94 IC1.14
  Bottom 0.152: v76.12,27.62 75.49,26.99 75.49,9.21 75.81,8.89 X34.P$2
N$42
  Top 0.152: IC7.6 31.04,58.74 32.63,58.74 32.94,58.42 32.94,50.8 7.54,50.8 5.64,52.7 5.64,78.42 9.13,78.42 10.08,77.47 10.08,73.66 X8.P$1
N$43  (via drill 0.3)
  Top 0.152: X35.P$1 R4.1 | v81.52,20.32 81.84,20.32 81.84,27.3 81.2,27.3 80.57,27.94 IC1.3
  Bottom 0.152: v81.52,20.32 79.3,18.1 X35.P$1
N$44
  Top 0.152: IC7.7 32.31,51.44 7.54,51.44 6.27,52.7 6.27,77.15 8.81,77.15 X8.P$2
N$45
  Top 0.152: 83.11,8.89 83.11,16.19 R3.1 | 83.11,8.89 84.38,7.62 92,7.62 92,20.32 90.41,21.91 88.82,21.91 88.82,25.4 81.84,32.38 78.98,32.38 78.98,30.16 79.3,29.84 79.62,29.84 80.25,29.21 IC1.4 | 83.11,8.89 X35.P$2
N$46
  Top 0.152: IC8.15 32.31,89.22 9.77,89.22 X9.P$1
N$47
  Top 0.152: X36.P$1 R2.1 86.28,16.51 87.24,17.46 90.73,17.46 90.73,20.32 90.41,20.64 87.55,20.64 87.55,24.13 81.84,29.84 81.2,29.84 80.57,30.48 IC1.5
N$48  (via drill 0.3)
  Top 0.152: IC8.1 31.04,75.25 v30.4,75.25
  Bottom 0.152: v30.4,75.25 28.18,75.25 27.86,75.56 27.86,77.47 16.12,89.22 12.31,89.22 12.31,90.17 11.67,90.8 X9.P$2
N$49  (via drill 0.3)
  Top 0.152: IC8.2 32.31,75.88 v31.04,75.88
  Bottom 0.152: v31.04,75.88 28.5,75.88 28.5,77.47 X10.P$1
N$50  (via drill 0.3)
  Top 0.152: IC8.3 33.58,75.56 v32.94,75.56
  Bottom 0.152: v32.94,75.56 19.29,89.22 19.29,90.17 18.66,90.8 X10.P$2
N$51
  Top 0.152: IC9.14 51.36,79.38 50.41,78.42 48.5,78.42 46.91,80.01 39.93,80.01 IC8.9
N$52  (via drill 0.3)
  Top 0.152: IC8.4 34.85,76.2 v33.58,76.2
  Bottom 0.152: v33.58,76.2 29.77,80.01 29.45,80.01 22.15,87.31 22.15,90.8 X11.P$1
N$53  (via drill 0.3)
  Top 0.152: v36.12,76.2 IC8.5 | v34.85,78.1 34.21,78.74 34.21,89.85 26.59,89.85 25.64,90.8 X11.P$2
  Bottom 0.152: v36.12,76.2 34.85,77.47 v34.85,78.1
N$54  (via drill 0.3)
  Top 0.152: v59.3,63.82 61.52,63.82 64.69,66.99 U$2.C | v58.66,44.13 57.07,42.55 R26.2
  Bottom 0.152: v59.3,63.82 58.66,63.18 v58.66,44.13
N$57
  Top 0.152: X36.P$2 90.09,8.89 90.09,16.19 R1.1 90.09,16.51 91.36,16.51 91.36,20.32 90.41,21.27 88.19,21.27 88.19,24.76 81.84,31.11 81.2,31.11 80.57,31.75 IC1.6
N$58  (via drill 0.3)
  Top 0.152: v60.88,65.72 U$3.C | v59.93,60.64 51.99,52.7 R27.2
  Bottom 0.152: v60.88,65.72 59.93,64.77 v59.93,60.64
N$59  (via drill 0.3)
  Top 0.152: IC8.6 37.39,72.39 30.4,72.39 29.77,73.03 v29.77,80.64
  Bottom 0.152: v29.77,80.64 29.13,81.28 29.13,90.8 X12.P$1
N$60  (via drill 0.3)
  Top 0.152: v38.66,75.56 IC8.7
  Bottom 0.152: v38.66,75.56 41.52,78.42 41.52,81.6 32.63,90.49 32.63,90.8 X12.P$2
N$61
  Top 0.152: IC9.15 50.09,89.85 37.07,89.85 X13.P$1
N$62  (via drill 0.3)
  Top 0.152: v48.82,75.56 IC9.1
  Bottom 0.152: v48.82,75.56 40.25,84.14 40.25,90.17 39.61,90.8 X13.P$2
N$63  (via drill 0.3)
  Top 0.152: v50.09,75.56 IC9.2
  Bottom 0.152: v50.09,75.56 43.1,82.55 43.1,90.8 X14.P$1
N$64  (via drill 0.3)
  Top 0.152: v51.36,75.56 IC9.3
  Bottom 0.152: v51.36,75.56 47.23,79.69 47.23,90.17 46.6,90.8 X14.P$2
N$65  (via drill 0.3)
  Top 0.152: v52.63,75.56 IC9.4
  Bottom 0.152: v52.63,75.56 50.09,78.1 50.09,90.8 X15.P$1
N$66  (via drill 0.3)
  Top 0.152: IC9.5 53.9,75.88 v54.53,75.88
  Bottom 0.152: v54.53,75.88 54.22,76.2 54.22,90.17 53.58,90.8 X15.P$2
N$67  (via drill 0.3)
  Top 0.152: IC9.6 55.17,76.84 v55.49,76.84
  Bottom 0.152: v55.49,76.84 56.76,78.1 56.76,90.8 X16.P$1
N$69  (via drill 0.3)
  Top 0.152: IC9.7 56.44,77.15 v57.71,77.15
  Bottom 0.152: v57.71,77.15 60.57,80.01 60.57,90.8 X16.P$2
N$71
  Top 0.152: IC10.15 70.41,68.9 82.16,68.9 X17.P$1
N$72  (via drill 0.3)
  Top 0.152: IC10.1 69.14,59.37 v73.58,59.37
  Bottom 0.152: v73.58,59.37 87.55,73.34 90.09,73.34 X17.P$2
N$73
  Top 0.152: IC10.2 70.41,58.74 73.27,58.74 73.58,58.42 73.58,55.88 76.12,55.88 76.12,58.74 85.65,58.74 89.78,54.61 90.41,54.61 91.36,55.56 91.36,61.59 89.78,61.59 88.82,62.55 88.82,69.85 X18.P$1
N$74
  Top 0.152: IC10.3 71.68,50.48 90.41,50.48 92.63,52.7 92.63,66.04 90.09,66.04 X18.P$2
N$75
  Top 0.152: IC10.4 72.95,51.44 89.46,51.44 89.78,51.12 90.41,51.12 92,52.7 92,62.86 X19.P$1
N$76
  Top 0.152: IC10.5 74.22,60.01 89.46,60.01 90.09,59.37 X19.P$2
N$77
  Top 0.152: IC10.6 75.49,59.37 86.6,59.37 X20.P$1
N$78
  Top 0.152: IC10.7 76.76,52.39 90.09,52.39 X20.P$2
N$79
  Top 0.152: IC11.15 70.41,45.72 71.04,45.72 71.36,45.4 75.81,45.4 76.12,45.72 76.12,48.89 X21.P$1
N$80  (via drill 0.3)
  Top 0.152: IC11.1 69.14,39.37 72.31,39.37 72.31,42.23 v85.33,42.23
  Bottom 0.152: v85.33,42.23 88.51,45.4 90.09,45.4 X21.P$2
N$81
  Top 0.152: IC11.2 70.41,43.5 88.51,43.5 X22.P$1
N$82
  Top 0.152: IC11.3 71.68,42.86 85.65,42.86 90.09,38.42 X22.P$2
N$83
  Top 0.152: IC11.4 72.95,35.56 89.46,35.56 X23.P$1
N$84  (via drill 0.3)
  Top 0.152: IC11.5 74.22,36.2 v85.33,36.2
  Bottom 0.152: v85.33,36.2 90.09,31.43 X23.P$2
N$85
  Top 0.152: IC11.6 75.49,36.83 89.46,36.83 90.09,36.2 90.41,36.2 91.36,35.24 91.36,27.94 X24.P$1
N$86
  Top 0.152: IC11.7 76.76,37.47 89.46,37.47 90.09,36.83 90.41,36.83 92,35.24 92,24.45 90.09,24.45 X24.P$2
RX
  Top 0.152: 64.69,70.17 64.69,73.98 66.6,73.98 IC2.1 | 64.69,70.17 U$2.A | ARDUINO_NANO1.17 45.33,70.17 64.69,70.17
TX
  Top 0.152: U$1.A 68.5,72.71 69.46,72.71 70.41,73.66 IC2.4 70.41,74.93 69.46,75.88 65.96,75.88 62.47,72.39 45.01,72.39 ARDUINO_NANO1.16
VCC  (via drill 0.3)
  Top 0.61: 64.69,79.38 66.6,79.38 IC2.8 | 64.69,79.38 62.47,79.38 61.52,78.42 C6.2 61.52,78.1 55.8,78.1 55.65,78.26 | X37.1 89.78,82.23 67.55,82.23 64.69,79.38 | IC10.10 76.76,60.96 70.41,60.96 68.82,62.55 IC10.16 69.14,63.18 67.87,61.91 64.06,61.91 C4.2 64.06,61.59 ARDUINO_NANO1.12 56.44,60.96 44.06,60.96 42.15,62.86 36.75,62.86 36.59,63.02 | 23.1,63.18 24.69,63.18 IC7.16 | 23.1,63.18 22.15,63.18 20.88,61.91 C7.2 | 32.31,60.96 IC7.10 | 32.31,60.96 25.32,60.96 23.1,63.18 | 55.65,78.26 56.44,79.06 IC9.10 | 55.65,78.26 53.9,76.52 44.69,76.52 43.74,75.56 C8.2 | IC8.16 31.04,77.15 v37.39,77.15 38.02,76.52 41.52,76.52 42.15,75.88 43.74,75.88 C8.2 | IC8.10 38.66,78.1 v38.34,78.1 | v40.88,80.64 48.18,80.64 48.82,80.01 IC9.16 | 32.31,60.96 34.53,60.96 36.59,63.02 | 36.59,63.02 40.56,66.99 40.56,72.07 43.74,75.25 C8.2 | 68.5,46.67 69.14,46.67 IC11.16 | 68.5,46.67 65.33,46.67 64.06,45.4 C5.2 64.06,45.08 55.17,45.08 | IC11.10 76.76,44.77 70.41,44.77 70.25,44.93 | 68.5,46.67 70.25,44.93 | 22.62,44.29 24.69,46.35 IC6.16 | 22.62,44.29 20.88,42.55 C9.2 | 32.31,44.77 32.31,44.13 22.78,44.13 22.62,44.29 | 32.31,44.77 IC6.10 | 55.17,45.08 41.52,45.08 41.2,44.77 32.31,44.77 | 37.39,19.37 34.21,19.37 R17.2 33.9,19.37 30.4,19.37 | v37.39,26.03 C2.2 | 37.39,19.37 v37.39,23.18 | C3.2 18.34,28.26 21.2,25.4 IC5.16 22.47,25.4 22.47,19.37 | 30.4,19.37 27.23,19.37 R19.2 26.91,19.37 23.42,19.37 | 23.42,19.37 22.47,19.37 | 22.47,19.37 20.24,19.37 R21.2 19.93,19.37 16.43,19.37 | R24.2 9.45,19.37 12.94,19.37 R23.2 13.26,19.37 16.43,19.37 | 16.43,19.37 R22.2 | 23.42,19.37 R20.2 | 30.4,19.37 R18.2 | C1.2 70.41,26.35 v71.04,26.35
  Top 0.61: v72,25.4 IC1.16 74.54,25.4 74.54,19.37 | 86.28,19.37 83.11,19.37 R3.2 82.79,19.37 79.3,19.37 | 86.28,19.37 89.78,19.37 R1.2 | 86.28,19.37 R2.2 | 79.3,19.37 76.12,19.37 R5.2 75.81,19.37 74.54,19.37 | 72.31,19.37 69.14,19.37 R7.2 68.82,19.37 65.33,19.37 | 65.33,19.37 62.15,19.37 R9.2 61.84,19.37 58.34,19.37 | 58.34,19.37 55.17,19.37 R11.2 54.85,19.37 51.36,19.37 | 44.37,19.37 41.2,19.37 R15.2 40.88,19.37 37.39,19.37 | 51.36,19.37 48.18,19.37 R13.2 48.18,19.68 46.6,19.68 | 46.6,19.68 46.6,22.86 IC3.16 | 44.37,19.37 44.69,19.68 46.6,19.68 | 44.37,19.37 R14.2 | 51.36,19.37 R12.2 | 58.34,19.37 R10.2 | 65.33,19.37 R8.2 | 72.31,19.37 74.54,19.37 | 72.31,19.37 R6.2 | 79.3,19.37 R4.2 | 37.39,19.37 R16.2 | v61.52,36.2 70.25,44.93 | 55.17,45.08 v55.17,49.21
  Bottom 0.61: v37.39,77.15 v38.34,78.1 v40.88,80.64 | v37.39,23.18 v37.39,26.03 | v72,25.4 v71.04,26.35 71.04,26.67 v61.52,36.2 | ARDUINO_NANO1.12 55.17,59.69 v55.17,49.21

### Text on the board
tPlace: RS485 | OUT | B | A | 17 | 18 | 19 | 20 | 21 | 22 | 23 | 24 | 25 | 26 | 27 | 28 | 29 | 30 | 31 | 32 | GND | GND | GND | 5V | 16 | 33 | 15 | 34 | 14 | 35 | 13 | 36 | 12 | 37 | 11 | 38 | 10 | 39 | 9 | 40 | 8 | 41 | 7 | 42 | 6 | RX | 43 | TX | 5 | 44 | 4 | 45 | 3 | 46 | 2 | 47 | 1 | 48 | 24x10k | IN | IN | 1 | 2 | 3 | 4 | 5 | 6 | 7 | 8 | 9 | 10 | 11 | 12 | 13 | 14 | 15 | 16 | 17 | 18 | 19 | 20 | 21 | 22 | 23 | 24
bPlace: Arduino-CMRI_SMD v7 / JMRI C/MRI emulator / https://tinyurl.com/vsy4jw3 / 22/04/2022 Erik Arckens